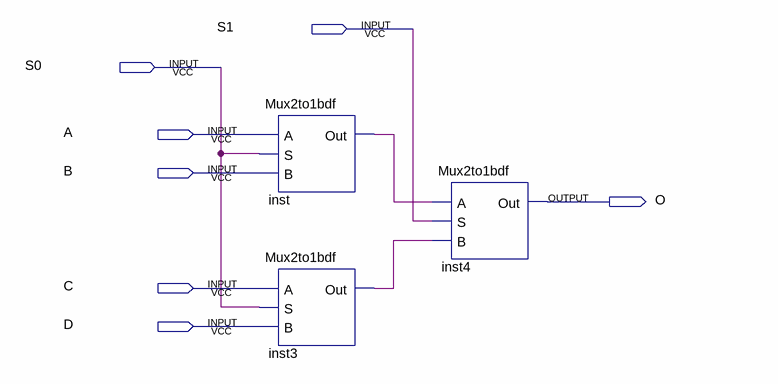
[diagram p0: schematic sheet]
// Quartus schematic Mux4to1_1bit.bdf as structural Verilog: 3 symbols, 7 pins
module Mux4to1_1bit (
  input  S1,
  input  S0,
  input  A,
  input  B,
  input  C,
  input  D,
  output O
);

  wire inst3_out, inst_out;

  Mux2to1bdf inst (.A(A), .S(S0), .B(B), .Out(inst_out));
  Mux2to1bdf inst3 (.A(C), .S(S0), .B(D), .Out(inst3_out));
  Mux2to1bdf inst4 (.A(inst_out), .S(S1), .B(inst3_out), .Out(O));
endmodule
